# EAGLE design main (EAGLE 6.2)
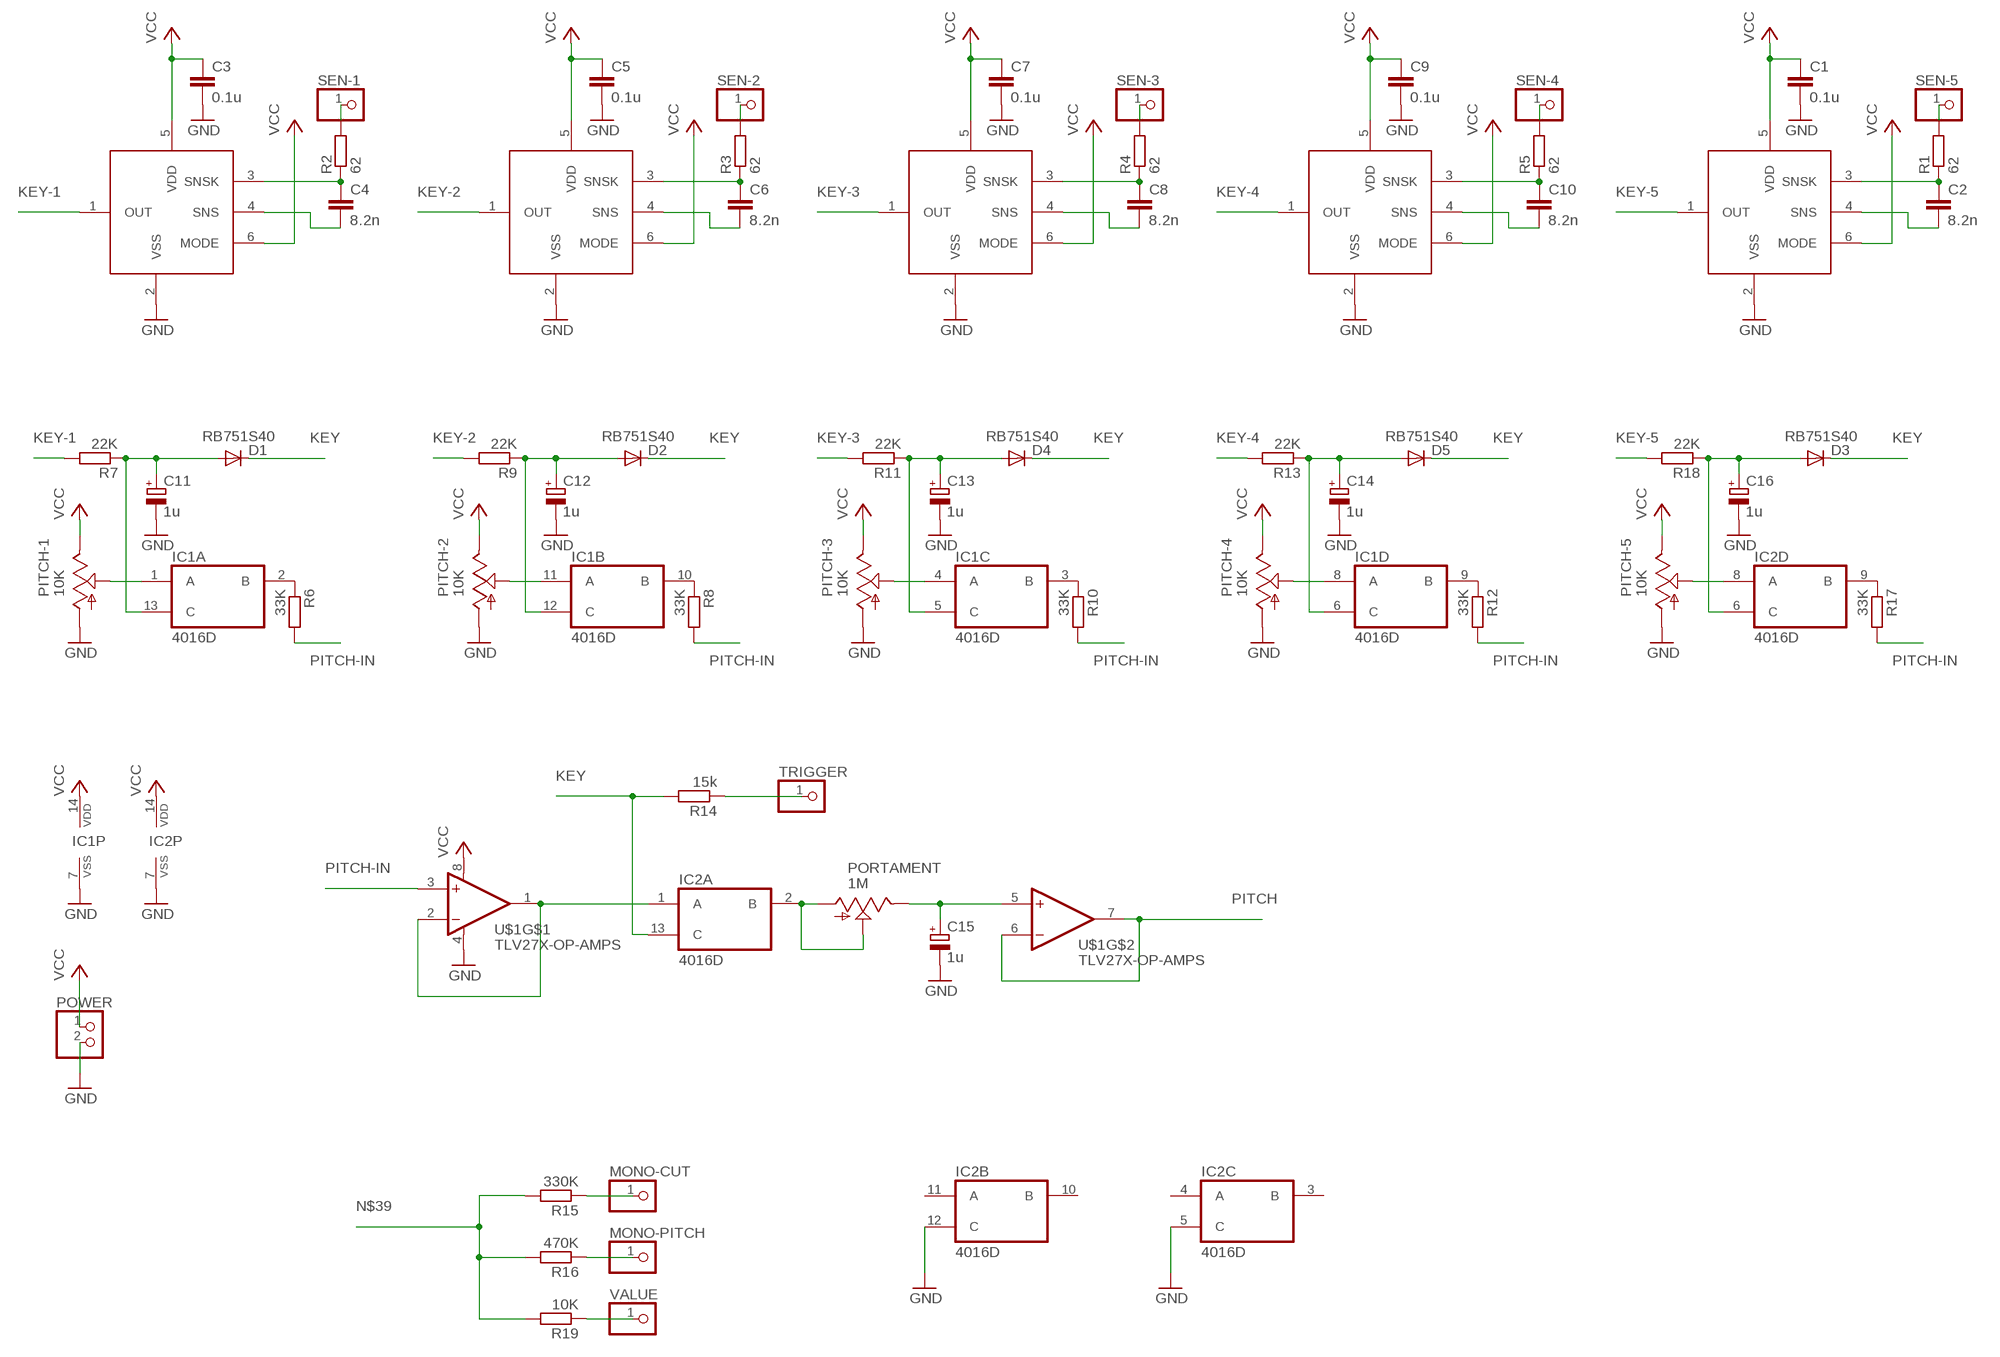
[diagram p0: schematic, sheet 1]

## Parts
C1  0.1u  C-EUC0805  [C0805]
C2  8.2n  C-EUC0805  [C0805]
C3  0.1u  C-EUC0805  [C0805]
C4  8.2n  C-EUC0805  [C0805]
C5  0.1u  C-EUC0805  [C0805]
C6  8.2n  C-EUC0805  [C0805]
C7  0.1u  C-EUC0805  [C0805]
C8  8.2n  C-EUC0805  [C0805]
C9  0.1u  C-EUC0805  [C0805]
C10  8.2n  C-EUC0805  [C0805]
C11  1u  CPOL-EUA  [PANASONIC_A]
C12  1u  CPOL-EUA  [PANASONIC_A]
C13  1u  CPOL-EUA  [PANASONIC_A]
C14  1u  CPOL-EUA  [PANASONIC_A]
C15  1u  CPOL-EUA  [PANASONIC_A]
C16  1u  CPOL-EUA  [PANASONIC_A]
D1  RB751S40  DIODE-SOD523  [SOD523]
D2  RB751S40  DIODE-SOD523  [SOD523]
D3  RB751S40  DIODE-SOD523  [SOD523]
D4  RB751S40  DIODE-SOD523  [SOD523]
D5  RB751S40  DIODE-SOD523  [SOD523]
IC1  4016D  [SO14]
IC2  4016D  [SO14]
MONO-CUT  PINHD-1X1  [1X01]
MONO-PITCH  PINHD-1X1  [1X01]
PITCH-1  10K  POT-PINHEADSTRAIGHT  [PIN-1X03]
PITCH-2  10K  POT-PINHEADSTRAIGHT  [PIN-1X03]
PITCH-3  10K  POT-PINHEADSTRAIGHT  [PIN-1X03]
PITCH-4  10K  POT-PINHEADSTRAIGHT  [PIN-1X03]
PITCH-5  10K  POT-PINHEADSTRAIGHT  [PIN-1X03]
PORTAMENT  1M  POT-PINHEADSTRAIGHT  [PIN-1X03]
POWER  PINHD-1X2  [1X02]
R1  62  R-EU_R0805  [R0805]
R2  62  R-EU_R0805  [R0805]
R3  62  R-EU_R0805  [R0805]
R4  62  R-EU_R0805  [R0805]
R5  62  R-EU_R0805  [R0805]
R6  33K  R-EU_R0805  [R0805]
R7  22K  R-EU_R0805  [R0805]
R8  33K  R-EU_R0805  [R0805]
R9  22K  R-EU_R0805  [R0805]
R10  33K  R-EU_R0805  [R0805]
R11  22K  R-EU_R0805  [R0805]
R12  33K  R-EU_R0805  [R0805]
R13  22K  R-EU_R0805  [R0805]
R14  15k  R-EU_R0805  [R0805]
R15  330K  R-EU_R0805  [R0805]
R16  470K  R-EU_R0805  [R0805]
R17  33K  R-EU_R0805  [R0805]
R18  22K  R-EU_R0805  [R0805]
R19  10K  R-EU_R0805  [R0805]
SEN-1  PINHD-1X1  [1X01]
SEN-2  PINHD-1X1  [1X01]
SEN-3  PINHD-1X1  [1X01]
SEN-4  PINHD-1X1  [1X01]
SEN-5  PINHD-1X1  [1X01]
TRIGGER  PINHD-1X1  [1X01]
U$1  TLV27X-OP-AMPS  [SOIC8]
U$2  AT42QT1010  [SOT23-6L]
U$3  AT42QT1010  [SOT23-6L]
U$4  AT42QT1010  [SOT23-6L]
U$5  AT42QT1010  [SOT23-6L]
U$6  AT42QT1010  [SOT23-6L]
VALUE  PINHD-1X1  [1X01]

## Nets
GND: C1.2 C3.2 C5.2 C7.2 C9.2 C11.- C12.- C13.- C14.- C15.- C16.- IC1.7(P:VSS) IC2.5(C:C) IC2.7(P:VSS) IC2.12(B:C) PITCH-1.1(A) PITCH-2.1(A) PITCH-3.1(A) PITCH-4.1(A) PITCH-5.1(A) POWER.2 U$1.4(V-) U$2.2(VSS) U$3.2(VSS) U$4.2(VSS) U$5.2(VSS) U$6.2(VSS)
KEY: D1.C D2.C D3.C D4.C D5.C IC2.13(A:C) R14.2
KEY-1: R7.2 U$2.1(OUT)
KEY-2: R9.2 U$3.1(OUT)
KEY-3: R11.2 U$4.1(OUT)
KEY-4: R13.2 U$5.1(OUT)
KEY-5: R18.2 U$6.1(OUT)
N$1: C4.2 U$2.4(SNS)
N$2: C4.1 R2.1 U$2.3(SNSK)
N$3: R2.2 SEN-1.1
N$4: C6.2 U$3.4(SNS)
N$5: C6.1 R3.1 U$3.3(SNSK)
N$6: R3.2 SEN-2.1
N$7: C8.2 U$4.4(SNS)
N$8: C8.1 R4.1 U$4.3(SNSK)
N$9: R4.2 SEN-3.1
N$10: C10.2 U$5.4(SNS)
N$11: C10.1 R5.1 U$5.3(SNSK)
N$12: R5.2 SEN-4.1
N$13: IC1.1(A:A) PITCH-1.2(S)
N$14: IC1.2(A:B) R6.1
N$15: C11.+ D1.A IC1.13(A:C) R7.1
N$16: IC1.11(B:A) PITCH-2.2(S)
N$17: IC1.10(B:B) R8.1
N$18: C12.+ D2.A IC1.12(B:C) R9.1
N$19: IC1.4(C:A) PITCH-3.2(S)
N$20: IC1.3(C:B) R10.1
N$21: C13.+ D4.A IC1.5(C:C) R11.1
N$22: IC1.8(D:A) PITCH-4.2(S)
N$23: IC1.9(D:B) R12.1
N$24: C14.+ D5.A IC1.6(D:C) R13.1
N$25: IC2.1(A:A) U$1.1(OUT) U$1.2(-IN)
N$26: IC2.2(A:B) PORTAMENT.1(A) PORTAMENT.2(S)
N$27: MONO-PITCH.1 R16.1
N$28: C15.+ PORTAMENT.3(E) U$1.5(+IN)
N$29: MONO-CUT.1 R15.1
N$30: C2.2 U$6.4(SNS)
N$31: C2.1 R1.1 U$6.3(SNSK)
N$32: R1.2 SEN-5.1
N$33: IC2.8(D:A) PITCH-5.2(S)
N$34: C16.+ D3.A IC2.6(D:C) R18.1
N$35: IC2.9(D:B) R17.1
N$39: R15.2 R16.2 R19.2
N$40: R19.1 VALUE.1
PITCH: U$1.6(-IN) U$1.7(OUT)
PITCH-IN: R6.2 R8.2 R10.2 R12.2 R17.2 U$1.3(+IN)
TRIG: R14.1 TRIGGER.1
VCC: C1.1 C3.1 C5.1 C7.1 C9.1 IC1.14(P:VDD) IC2.14(P:VDD) PITCH-1.3(E) PITCH-2.3(E) PITCH-3.3(E) PITCH-4.3(E) PITCH-5.3(E) POWER.1 U$1.8(V+) U$2.5(VDD) U$2.6(MODE) U$3.5(VDD) U$3.6(MODE) U$4.5(VDD) U$4.6(MODE) U$5.5(VDD) U$5.6(MODE) U$6.5(VDD) U$6.6(MODE)
Unconnected: IC2.3(C:B) IC2.4(C:A) IC2.10(B:B) IC2.11(B:A)

## Library data of the parts
C1-C10 = rcl:C-EU: CAPACITOR, European symbol
C11-C16 = rcl:CPOL-EU: POLARIZED CAPACITOR, European symbol
D1-D5 = diode:DIODE-: DIODE
IC1 IC2 = 40xx:4016: Quad bilateral ANALOG SWITCH
MONO-CUT MONO-PITCH SEN-1-SEN-5 TRIGGER VALUE = pinhead:PINHD-1X1: PIN HEADER
PITCH-1-PITCH-5 PORTAMENT = adam - mechanical:POT-PINHEAD
POWER = pinhead:PINHD-1X2: PIN HEADER
R1-R19 = rcl:R-EU_: RESISTOR, European symbol
U$1 = adam - ics:TLV27X-OP-AMPS: TLV272 rail to rail audio quality opamp
U$2-U$6 = adam - ics:AT42QT1010: Single channel touch sensor driver.

## Board
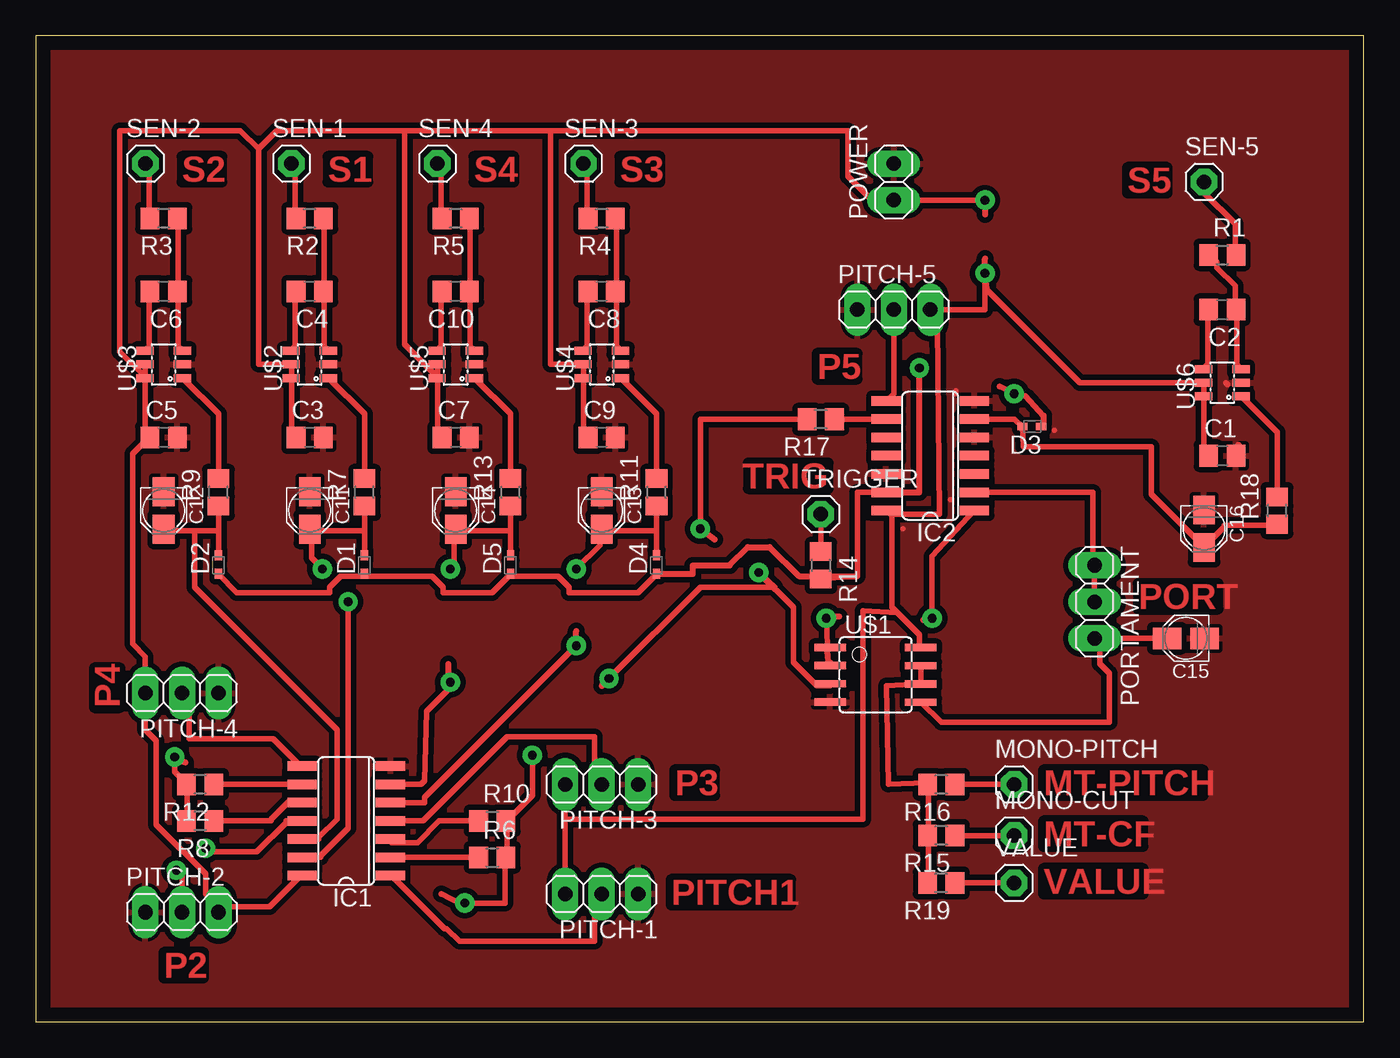
[diagram p1: board, top side]
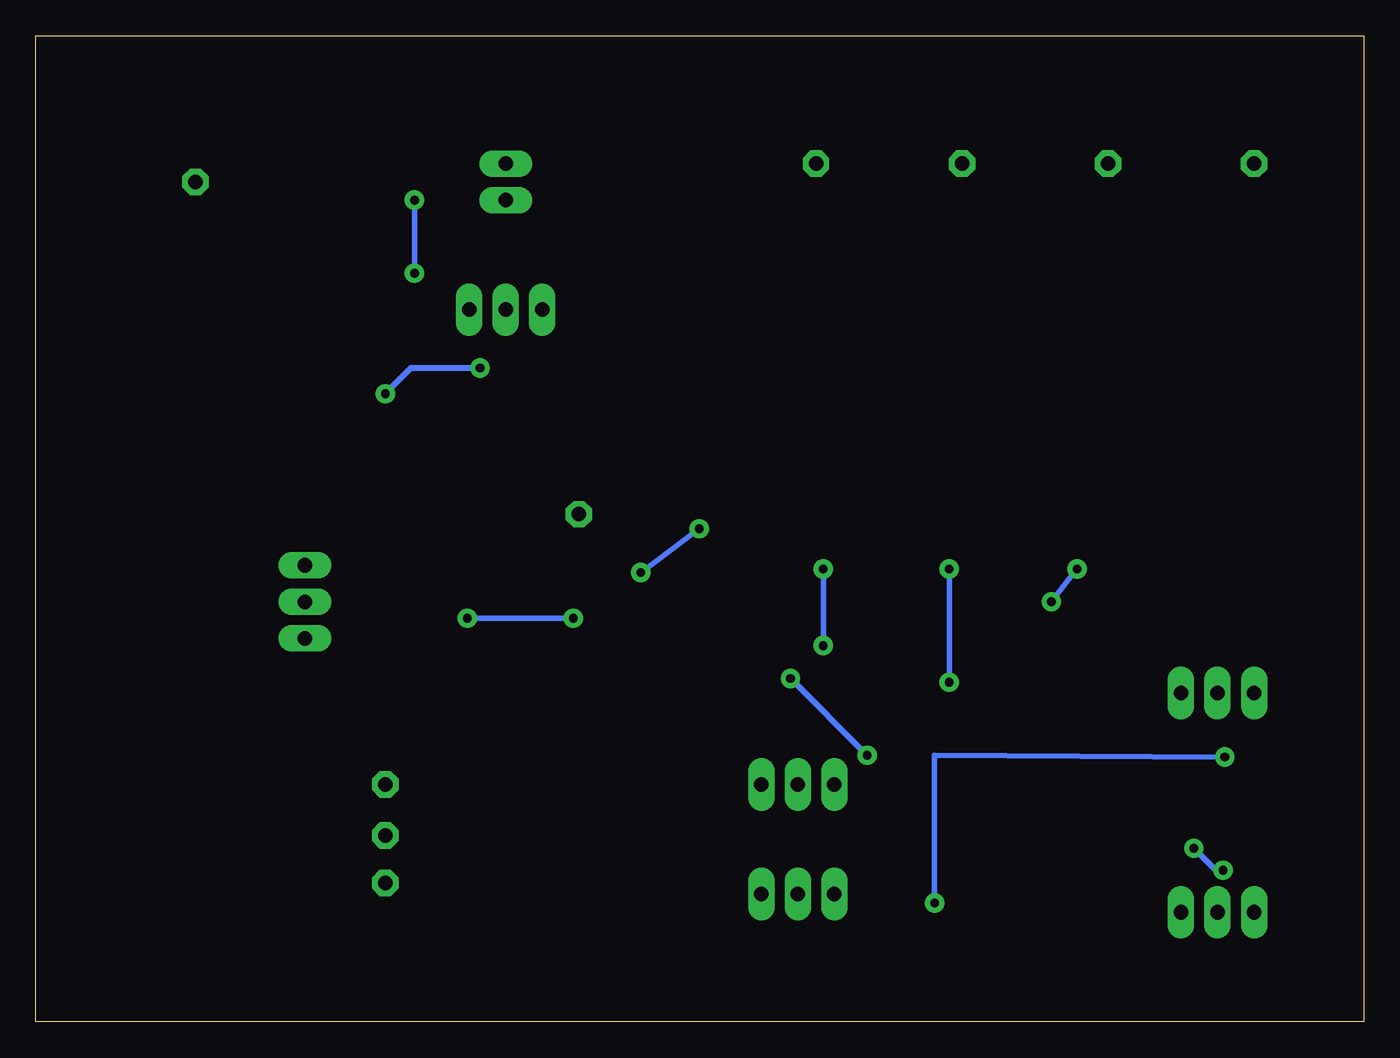
[diagram p2: board, bottom side, seen from below]

Size 92.38 x 68.57 mm. Coordinates in mm from the lower left corner, seen from the top.
Outline: 0,0 92.38,0 92.38,68.57 0,68.57 0,0
Copper layers (1*16): Top 0.035mm / dielectric 1.5mm / Bottom 0.035mm
Design rules: minimum track width 15mil, minimum drill 24mil, track to track 15mil, track to pad 15mil, pad to pad 8mil, via to via 15mil, smd to smd 8mil, copper to edge 40mil, drill to drill 8mil, minimum pad ring 10mil, minimum via ring 8mil, stop-mask expansion 4mil, vias tented up to drill 0mil, thermal gap 10mil

### Footprints (pad centres in the part's own frame; a part is rotated, then mirrored left to right if it is on the bottom)
C0805 = smd 1.3 x 1.5: 1 -0.95,0; 2 0.95,0
PANASONIC_A = smd 2 x 1.5: + 1.3,0; - -1.3,0
SOD523 = smd 0.7 x 0.5: A 0.7,0; C -0.6,0
SO14 = smd 0.66 x 2.032: 1 -3.81,-3.073; 2 -2.54,-3.073; 3 -1.27,-3.073; 4 0,-3.073; 5 1.27,-3.073; 6 2.54,-3.073; 7 3.81,-3.073; 8 3.81,3.073; 9 2.54,3.073; 10 1.27,3.073; 11 0,3.073; 12 -1.27,3.073; 13 -2.54,3.073; 14 -3.81,3.073
1X01 = drill 1.016 octagon: 1 0,0
PIN-1X03 = drill 1.016 long: 1 -2.54,0; 2 0,0; 3 2.54,0
1X02 = drill 1.016 long: 1 -1.27,0; 2 1.27,0
R0805 = smd 1.3 x 1.5: 1 -0.95,0; 2 0.95,0
SOIC8 = smd 0.5 x 2.2: 1 -1.905,-3.154; 2 -0.645,-3.154; 3 0.625,-3.154; 4 1.895,-3.154; 5 1.905,3.154; 6 0.635,3.154; 7 -0.635,3.154; 8 -1.905,3.154
SOT23-6L = smd 0.55 x 1.2: 1 -0.95,-1.3; 2 0,-1.3; 3 0.95,-1.3; 4 0.95,1.3; 5 0,1.3; 6 -0.95,1.3

### Placement (x,y rotation side)
C1  82.55,39.37 0 top
C2  82.55,49.53 180 top
C3  19.05,40.64 0 top
C4  19.05,50.8 180 top
C5  8.89,40.64 0 top
C6  8.89,50.8 180 top
C7  29.21,40.64 0 top
C8  39.37,50.8 180 top
C9  39.37,40.64 0 top
C10  29.21,50.8 180 top
C11  19.05,35.56 270 top
C12  8.89,35.56 270 top
C13  39.37,35.56 270 top
C14  29.21,35.56 270 top
C15  80.01,26.67 180 top
C16  81.28,34.29 270 top
D1  22.86,31.75 90 top
D2  12.7,31.75 90 top
D3  69.34,41.4 180 top
D4  43.18,31.75 90 top
D5  33.02,31.75 90 top
IC1  21.59,13.97 90 top
IC2  62.23,39.37 90 top
MONO-CUT  68.07,12.95 0 top
MONO-PITCH  68.07,16.51 0 top
PITCH-1  39.37,8.89 180 top
PITCH-2  10.16,7.62 0 top
PITCH-3  39.37,16.51 180 top
PITCH-4  10.16,22.86 180 top
PITCH-5  59.69,49.53 0 top
PORTAMENT  73.66,29.21 270 top
POWER  59.69,58.42 90 top
R1  82.55,53.34 0 top
R2  19.05,55.88 180 top
R3  8.89,55.88 180 top
R4  39.37,55.88 180 top
R5  29.21,55.88 180 top
R6  31.75,11.43 0 top
R7  22.86,36.83 90 top
R8  11.43,13.97 180 top
R9  12.7,36.83 90 top
R10  31.75,13.97 0 top
R11  43.18,36.83 90 top
R12  11.43,16.51 180 top
R13  33.02,36.83 90 top
R14  54.61,31.75 270 top
R15  62.99,12.95 180 top
R16  62.99,16.51 180 top
R17  54.61,41.91 180 top
R18  86.36,35.56 90 top
R19  62.99,9.65 180 top
SEN-1  17.78,59.69 0 top
SEN-2  7.62,59.69 0 top
SEN-3  38.1,59.69 0 top
SEN-4  27.94,59.69 0 top
SEN-5  81.28,58.42 0 top
TRIGGER  54.61,35.31 0 top
U$1  58.42,24.13 270 top
U$2  19.05,45.72 90 top
U$3  8.89,45.72 90 top
U$4  39.37,45.72 90 top
U$5  29.21,45.72 90 top
U$6  82.55,44.45 90 top
VALUE  68.07,9.65 0 top

### Tracks (layer width: path | path; a pad name or v marks a point on that pad's centre or on a via)
GND
  Top 0.381: 63.63,36.32 63.7,36.32 | 64.01,43.69 64.01,43.88 | 82.93,44.32 82.79,44.45 | 70.87,41.15 70.88,41.15 | 83.69,40.13 83.62,40.13 | 81.15,36.07 C16.- | 60.33,34.29 60.34,34.29
  pour Top (isolate 0.254): 0,68.58 92.71,68.58 92.71,0 0,0
KEY  (via drill 0.61)
  Top 0.381: IC2.13 57.15,36.83 57.15,30.99 | D2.C 12.7,31.12 13.97,29.84 20.45,29.84 20.45,30.23 21.21,30.99 22.86,30.99 D1.C 22.99,30.99 27.56,30.99 28.32,30.23 28.32,29.84 31.75,29.84 33.02,31.12 D5.C 33.15,30.99 36.32,30.99 37.08,30.23 37.08,29.84 41.91,29.84 43.18,31.12 D4.C
  Top 0.406: R14.2 57.15,30.99 53.09,30.99 51.05,33.02 49.53,33.02 48.26,31.75 45.72,31.75 45.72,31.15 D4.C | v61.47,45.47 61.47,36.83 IC2.13 | D3.C 70.1,41.66 70.1,42.16 68.83,43.53 v68.07,43.69 67.06,44.2
  Bottom 0.406: v61.47,45.47 66.29,45.47 v68.07,43.69
KEY-1
  Top 0.381: R7.2 22.86,42.29 20.45,44.7 U$2.1
KEY-2
  Top 0.381: R9.2 12.7,42.29 10.29,44.7 U$3.1
KEY-3
  Top 0.381: R11.2 43.18,42.29 40.77,44.7 U$4.1
KEY-4
  Top 0.381: R13.2 33.02,42.29 30.61,44.7 U$5.1
KEY-5
  Top 0.381: R18.2 86.36,41.02 83.95,43.43 U$6.1
N$1
  Top 0.381: U$2.4 17.78,46.74 18.03,46.99 18.03,50.8 C4.2
N$2
  Top 0.381: U$2.3 20.32,46.74 20.07,46.99 20.07,50.8 C4.1 20.07,50.93 20.07,55.88 R2.1
N$3
  Top 0.381: SEN-1.1 18.03,59.44 18.03,55.88 R2.2
N$4
  Top 0.381: U$3.4 7.62,46.74 7.87,46.99 7.87,50.8 C6.2
N$5
  Top 0.381: U$3.3 10.16,46.74 9.91,46.99 9.91,50.8 C6.1 9.91,50.93 9.91,55.88 R3.1
N$6
  Top 0.381: SEN-2.1 7.87,59.44 7.87,55.88 R3.2
N$7
  Top 0.381: U$4.4 38.1,46.74 38.35,46.99 38.35,50.8 C8.2
N$8
  Top 0.381: U$4.3 40.64,46.74 40.39,46.99 40.39,50.8 C8.1 40.39,50.93 40.39,55.88 R4.1
N$9
  Top 0.381: SEN-3.1 38.35,59.44 38.35,55.88 R4.2
N$10
  Top 0.381: U$5.4 27.94,46.74 28.19,46.99 28.19,50.8 C10.2
N$11
  Top 0.381: U$5.3 30.48,46.74 30.23,46.99 30.23,50.8 C10.1 30.23,50.93 30.23,55.88 R5.1
N$12
  Top 0.381: SEN-4.1 28.19,59.44 28.19,55.88 R5.2
N$13
  Top 0.381: PITCH-1.2 39.37,7.75 38.86,7.24 38.86,5.59 29.46,5.59 28.57,6.48 28.45,6.48 24.77,10.16 IC1.1
N$14
  Top 0.381: IC1.2 R6.1
N$15  (via drill 0.61)
  Top 0.381: R7.1 22.86,34.16 | 22.86,34.16 D1.A | 22.86,34.16 19.05,34.16 C11.+ 19.18,34.04 19.18,32.26 v19.94,31.5 | IC1.13 19.81,11.43 19.81,11.56 21.72,13.46 v21.72,29.21
  Bottom 0.381: v19.94,31.5 v21.72,29.21
N$16  (via drill 0.61)
  Top 0.381: IC1.11 17.4,13.97 17.4,13.84 15.37,11.81 11.81,11.81 v11.81,12.07 | v9.78,10.54 10.16,10.16 PITCH-2.2
  Bottom 0.381: v11.81,12.07 10.29,10.54 v9.78,10.54
N$17
  Top 0.381: R8.1 16.38,13.97 16.38,14.1 17.65,15.37 18.41,15.37 18.41,15.24 IC1.10
N$18
  Top 0.381: R9.1 12.7,34.16 | 12.7,34.16 D2.A | 12.7,34.16 11.05,34.16 | 11.05,34.16 8.89,34.16 C12.+ | IC1.12 19.68,12.7 19.68,12.83 20.95,14.1 20.95,20.32 11.05,30.23 11.05,34.16
N$19
  Top 0.381: IC1.4 26.92,13.97 32.77,19.81 38.86,19.81 38.86,18.16 39.37,17.65 PITCH-3.2
N$20
  Top 0.381: R10.1 28.07,13.97 26.54,12.45 24.77,12.45 24.77,12.7 IC1.3
N$21  (via drill 0.61)
  Top 0.381: R11.1 43.18,34.16 | 43.18,34.16 D4.A | 43.18,34.16 39.37,34.16 C13.+ 39.24,34.04 39.24,33.15 v37.59,31.5 | IC1.5 27.05,15.24 27.05,15.62 v37.59,26.16
  Top 0.406: v37.59,26.16 37.59,27.18
  Bottom 0.381: v37.59,31.5 v37.59,26.16
N$22
  Top 0.381: PITCH-4.2 10.16,21.72 10.67,21.21 10.67,19.68 16.51,19.68 18.41,17.78 IC1.8
N$23
  Top 0.381: IC1.9 R12.1
N$24  (via drill 0.61)
  Top 0.381: R13.1 33.02,34.16 | 33.02,34.16 D5.A | 33.02,34.16 29.21,34.16 C14.+ 29.08,34.04 29.08,31.75 v28.83,31.5 | IC1.6 26.8,16.51 27.05,16.76 27.18,21.59 28.96,23.37 v28.83,23.62
  Bottom 0.381: v28.83,31.5 v28.83,23.62
N$25  (via drill 0.61)
  Top 0.381: v62.36,28.07 62.36,32.38 65.28,35.56 IC2.1 | 55.12,25.15 55.37,24.89 U$1.2 | 55.12,25.15 v54.99,28.07 | U$1.1 55.37,26.04 54.99,26.16 54.99,26.04 55.12,25.15
  Bottom 0.381: v54.99,28.07 v62.36,28.07
N$26
  Top 0.381: PORTAMENT.2 PORTAMENT.1 73.53,31.88 73.53,36.83 IC2.2
N$27
  Top 0.381: MONO-PITCH.1 R16.1
N$28
  Top 0.381: C15.+ PORTAMENT.3 74.04,26.54 74.04,24.89 74.68,24.26 74.68,20.83 62.99,20.83 61.59,22.23 U$1.5
N$29
  Top 0.381: MONO-CUT.1 R15.1
N$30
  Top 0.381: U$6.4 81.28,45.47 81.53,45.72 81.53,49.53 C2.2
N$31
  Top 0.381: U$6.3 83.82,45.47 83.57,45.72 83.57,49.53 C2.1 83.44,49.66 83.44,51.18 82.17,52.45 82.17,52.83 81.66,53.34 R1.1
N$32
  Top 0.381: SEN-5.1 81.28,57.66 83.44,55.5 83.44,53.34 R1.2
N$33
  Top 0.381: PITCH-5.2 59.69,43.69 59.18,43.18 IC2.8
N$34
  Top 0.381: IC2.6 68.07,41.91 D3.A 68.71,40.01 77.6,40.01 77.6,36.7 81.15,33.15 C16.+ 81.28,33.02 82.68,34.42 82.68,34.54 86.36,34.54 R18.1
N$35
  Top 0.381: IC2.9 R17.1
N$36
  Top 0.406: 28.7,23.62 28.7,24.89
N$37
  Top 0.406: 55.12,28.19 55.88,28.19
N$38
  Top 0.406: 62.23,27.94 61.72,27.94
N$39
  Top 0.381: R16.2 62.1,16.51 62.1,12.95 R15.2 62.1,12.83 62.1,9.65 R19.2
N$40
  Top 0.381: VALUE.1 R19.1
PITCH
  Top 0.381: U$1.7 61.59,24.77 61.59,23.49 U$1.6 59.18,23.37 59.31,16.51 61.98,16.64
PITCH-IN  (via drill 0.61)
  Top 0.381: R8.2 10.54,13.97 10.54,16.51 R12.2 10.41,16.64 9.65,17.4 9.65,18.29 v9.65,18.41 | R17.2 46.23,41.91 v46.23,34.29 | U$1.3 55.24,23.49 55.24,23.37 54.36,23.37 52.7,25.02 52.7,28.83 v50.29,31.24 50.16,31.37 51.44,30.23 46.23,30.23 v39.88,23.88 | v34.54,18.54 34.54,15.75 32.89,14.1 R10.2 32.77,13.97 32.77,11.43 R6.2 32.64,11.3 32.64,8.25 v29.84,8.25 29.72,8.25 29.67,8.15
  Top 0.406: v39.88,23.88 39.37,23.37 | 29.72,8.13 29.67,8.15 28.19,8.89 | 9.65,18.29 10.41,18.03 | v46.23,34.29 47.24,33.53
  Bottom 0.381: v50.29,31.24 v46.23,34.29 | v39.88,23.88 v34.54,18.54 | v9.65,18.41 29.84,18.54 v29.84,8.25
TRIG
  Top 0.381: TRIGGER.1 R14.1
VCC  (via drill 0.61)
  Top 0.381: C9.1 38.35,40.64 38.1,40.89 38.1,44.7 U$4.6 38.1,44.83 38.1,45.72 U$4.5 35.81,45.72 35.81,61.98 | C3.1 18.03,40.64 17.78,40.89 17.78,44.7 U$2.6 17.78,44.83 17.78,45.72 U$2.5 15.49,45.72 15.49,60.71 | U$5.6 27.94,44.83 27.94,45.72 U$5.5 | C7.1 28.19,40.64 27.94,40.89 27.94,44.7 U$5.6 | 15.49,60.71 16.76,61.98 25.65,61.98 | 25.65,61.98 25.65,47.12 27.81,44.96 U$5.6 | 25.65,61.98 35.81,61.98 | IC1.14 18.41,10.16 16.26,8 12.7,8 PITCH-2.3 12.57,8.13 11.81,8.89 11.81,10.29 8.38,13.72 8.38,19.56 7.62,20.32 PITCH-4.3 7.62,25.4 6.73,26.29 6.73,39.5 7.75,40.51 C5.1 7.87,40.64 7.62,40.89 7.62,44.7 U$3.6 | U$3.6 7.62,44.83 7.62,45.72 U$3.5 | 15.49,60.71 14.22,61.98 5.84,61.98 5.84,46.61 7.49,44.96 U$3.6 | C1.1 81.53,39.37 81.28,39.62 81.28,43.43 U$6.6 81.28,43.56 81.28,44.45 U$6.5 72.64,44.45 66.17,50.93 | v66.04,57.15 POWER.1 59.56,57.28 58.04,57.28 56.52,58.8 56.52,61.98 35.81,61.98 | PITCH-3.3 36.83,14.1 | 36.83,14.1 PITCH-1.3 | 59.94,28.45 61.47,26.92 61.47,26.04 U$1.8 | 59.94,28.45 59.56,28.83 59.56,35.18 59.18,35.56 IC2.14 59.69,35.31 62.87,35.31 62.74,48.51 62.1,49.4 PITCH-5.3 66.04,49.53 v66.04,52.07 66.17,50.93 | 66.17,50.93 66.04,51.05 66.17,51.05 66.17,50.93 | 36.83,14.1 57.53,14.1 57.53,28.58 59.94,28.45
  Top 0.406: v66.04,57.15 66.04,56.13 | v66.04,52.07 66.04,53.09
  Bottom 0.381: v66.04,52.07 v66.04,57.15

### Text on the board
Top: S2 | S1 | S4 | S3 | S5 | P5 | TRIG | PORT | P4 | P3 | MT-PITCH | MT-CF | PITCH1 | VALUE | P2